# EAGLE design 4520_divider (EAGLE 7.5.0)
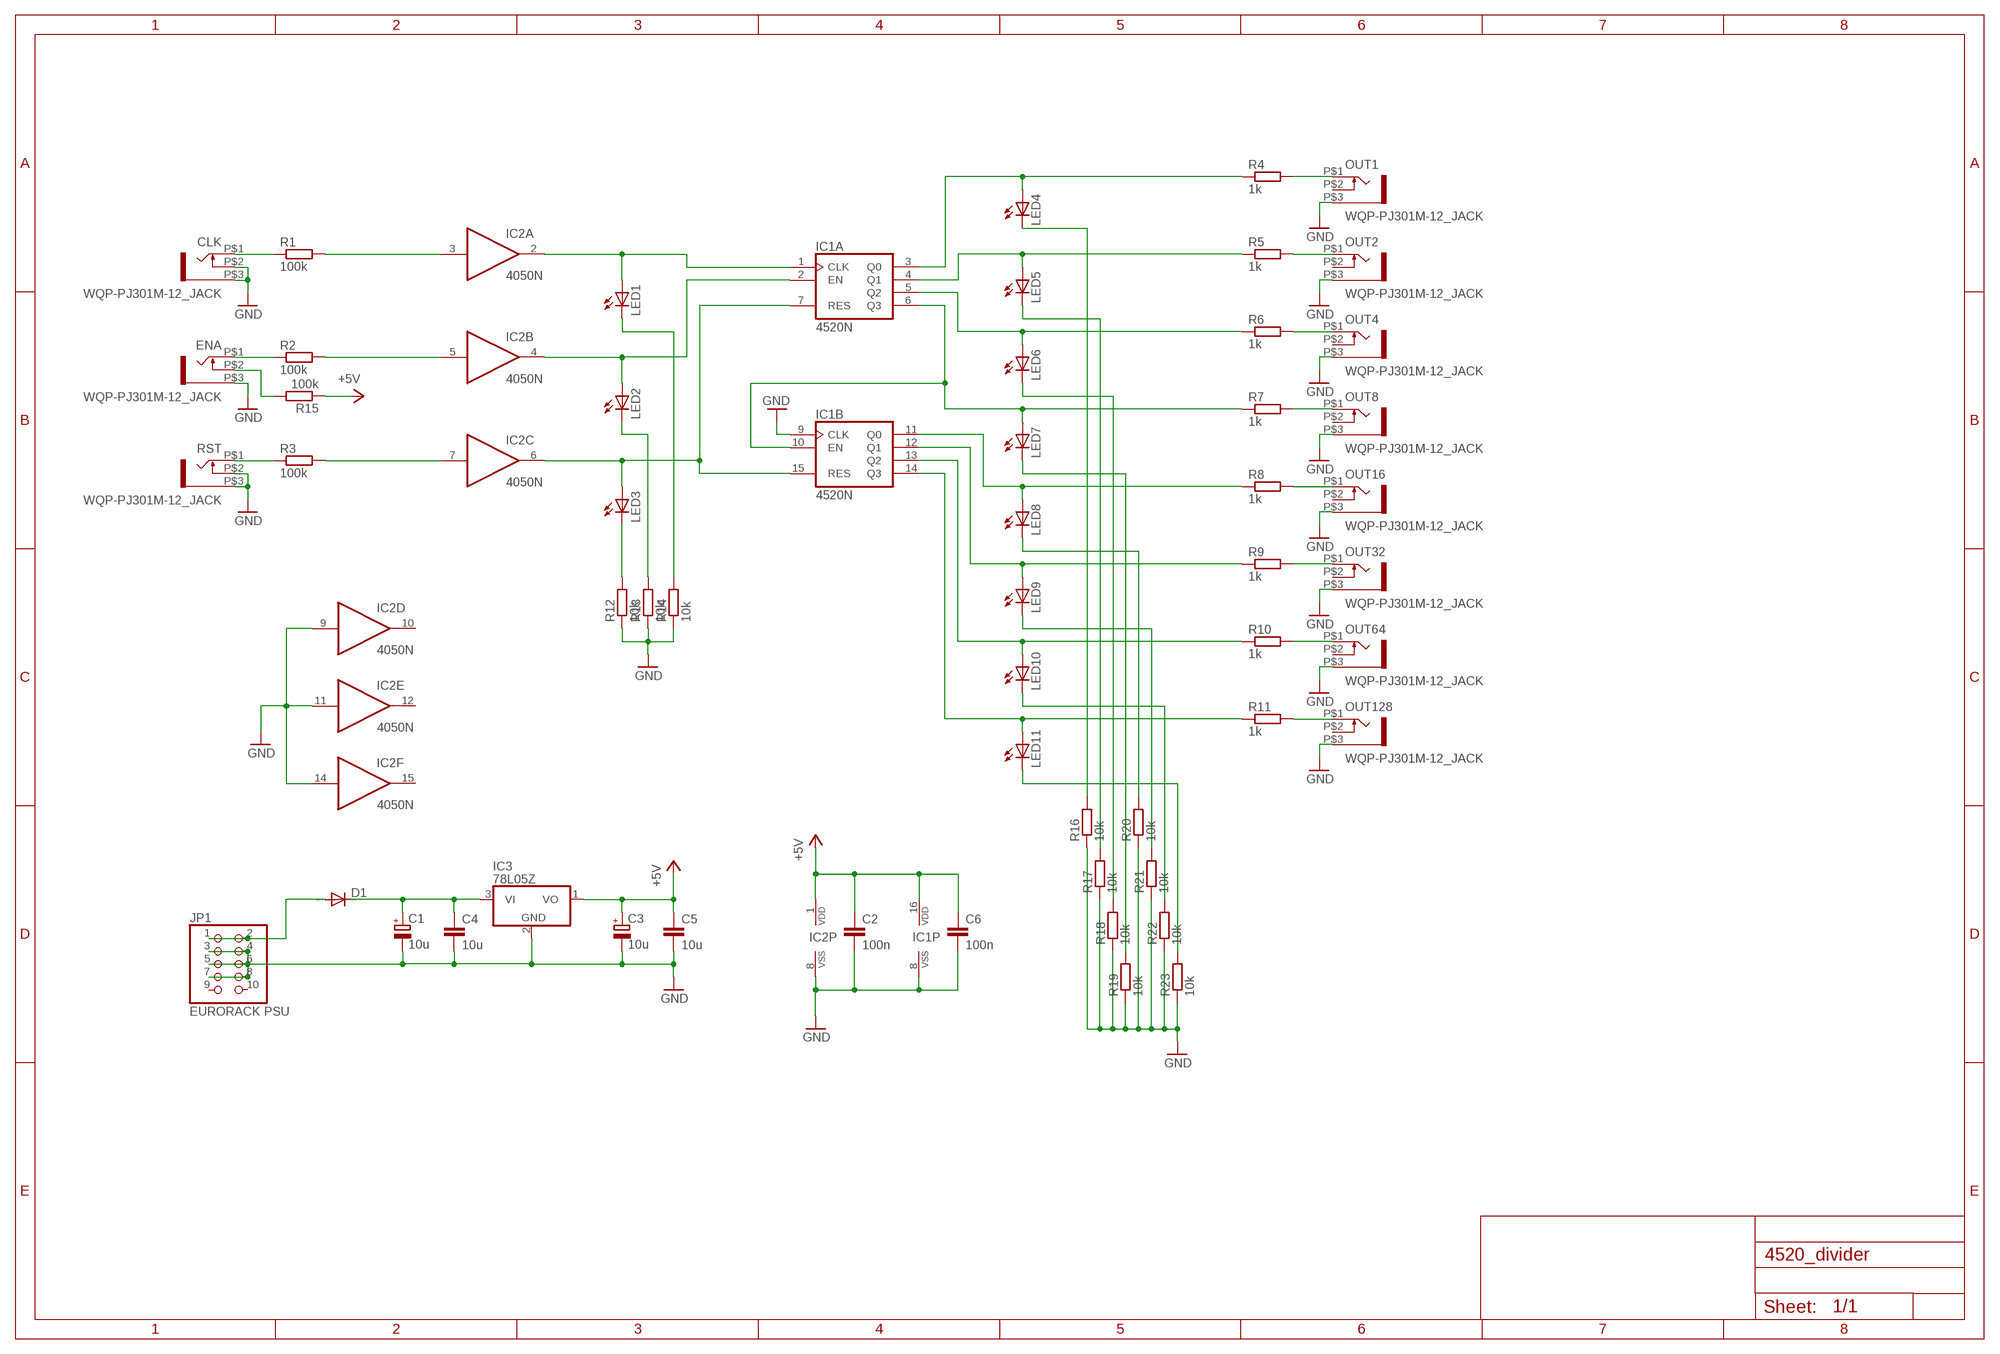
[diagram p0: schematic, sheet 1]

## Parts
C1  10u  CPOL-EUE2.5-5  [E2,5-5]
C2  100n  C-EU025-025X050  [C025-025X050]
C3  10u  CPOL-EUE2.5-5  [E2,5-5]
C4  10u  C-EUC1206K  [C1206K]
C5  10u  C-EUC1206K  [C1206K]
C6  100n  C-EU025-025X050  [C025-025X050]
CLK  WQP-PJ301M-12_JACK  [WQP-PJ301M-12_JACK]
D1  DIODE-D-2.5  [D-2.5]
ENA  WQP-PJ301M-12_JACK  [WQP-PJ301M-12_JACK]
IC1  4520N  [DIL16]
IC2  4050N  [DIL16]
IC3  78L05Z  [TO92]
JP1  EURORACK PSU  PINHD-2X5  [2X05]
LED1  LED3MM  [LED3MM]
LED2  LED3MM  [LED3MM]
LED3  LED3MM  [LED3MM]
LED4  LED3MM  [LED3MM]
LED5  LED3MM  [LED3MM]
LED6  LED3MM  [LED3MM]
LED7  LED3MM  [LED3MM]
LED8  LED3MM  [LED3MM]
LED9  LED3MM  [LED3MM]
LED10  LED3MM  [LED3MM]
LED11  LED3MM  [LED3MM]
OUT1  WQP-PJ301M-12_JACK  [WQP-PJ301M-12_JACK]
OUT2  WQP-PJ301M-12_JACK  [WQP-PJ301M-12_JACK]
OUT4  WQP-PJ301M-12_JACK  [WQP-PJ301M-12_JACK]
OUT8  WQP-PJ301M-12_JACK  [WQP-PJ301M-12_JACK]
OUT16  WQP-PJ301M-12_JACK  [WQP-PJ301M-12_JACK]
OUT32  WQP-PJ301M-12_JACK  [WQP-PJ301M-12_JACK]
OUT64  WQP-PJ301M-12_JACK  [WQP-PJ301M-12_JACK]
OUT128  WQP-PJ301M-12_JACK  [WQP-PJ301M-12_JACK]
R1  100k  R-EU_0204/2V  [0204V]
R2  100k  R-EU_0204/2V  [0204V]
R3  100k  R-EU_0204/2V  [0204V]
R4  1k  R-EU_R1206  [R1206]
R5  1k  R-EU_R1206  [R1206]
R6  1k  R-EU_R1206  [R1206]
R7  1k  R-EU_R1206  [R1206]
R8  1k  R-EU_R1206  [R1206]
R9  1k  R-EU_R1206  [R1206]
R10  1k  R-EU_R1206  [R1206]
R11  1k  R-EU_R1206  [R1206]
R12  10k  R-EU_R1206  [R1206]
R13  10k  R-EU_R1206  [R1206]
R14  10k  R-EU_R1206  [R1206]
R15  100k  R-EU_0204/2V  [0204V]
R16  10k  R-EU_R1206  [R1206]
R17  10k  R-EU_R1206  [R1206]
R18  10k  R-EU_R1206  [R1206]
R19  10k  R-EU_R1206  [R1206]
R20  10k  R-EU_R1206  [R1206]
R21  10k  R-EU_R1206  [R1206]
R22  10k  R-EU_R1206  [R1206]
R23  10k  R-EU_R1206  [R1206]
RST  WQP-PJ301M-12_JACK  [WQP-PJ301M-12_JACK]

## Nets
+5V: C2.1 C3.+ C5.1 C6.1 IC1.16(P:VDD) IC2.1(P:VDD) IC3.1(VO) R15.1
+12V_IN: D1.A JP1.1 JP1.2
GND: C1.- C2.2 C3.- C4.2 C5.2 C6.2 CLK.P$2 CLK.P$3 ENA.P$3 IC1.8(P:VSS) IC1.9(B:CLK) IC2.8(P:VSS) IC2.9(D:I) IC2.11(E:I) IC2.14(F:I) IC3.2(GND) JP1.3 JP1.4 JP1.5 JP1.6 JP1.7 JP1.8 OUT1.P$3 OUT2.P$3 OUT4.P$3 OUT8.P$3 OUT16.P$3 OUT32.P$3 OUT64.P$3 OUT128.P$3 R12.1 R13.1 R14.1 R16.1 R17.1 R18.1 R19.1 R20.1 R21.1 R22.1 R23.1 RST.P$2 RST.P$3
N$1: OUT1.P$1 R4.2
N$2: IC1.4(A:Q1) LED5.A R5.1
N$3: IC1.3(A:Q0) LED4.A R4.1
N$4: LED4.K(C) R16.2
N$5: OUT2.P$1 R5.2
N$6: OUT4.P$1 R6.2
N$7: C1.+ C4.1 D1.C IC3.3(VI)
N$8: IC1.5(A:Q2) LED6.A R6.1
N$9: LED5.K(C) R17.2
N$10: LED6.K(C) R18.2
N$11: LED7.K(C) R19.2
N$12: LED8.K(C) R20.2
N$13: LED9.K(C) R21.2
N$14: LED10.K(C) R22.2
N$15: LED11.K(C) R23.2
N$16: OUT8.P$1 R7.2
N$17: OUT16.P$1 R8.2
N$18: OUT32.P$1 R9.2
N$19: OUT64.P$1 R10.2
N$20: OUT128.P$1 R11.2
N$21: IC1.6(A:Q3) IC1.10(B:EN) LED7.A R7.1
N$22: IC1.11(B:Q0) LED8.A R8.1
N$23: IC1.12(B:Q1) LED9.A R9.1
N$24: IC1.13(B:Q2) LED10.A R10.1
N$25: IC1.14(B:Q3) LED11.A R11.1
N$26: IC2.3(A:I) R1.2
N$27: IC2.5(B:I) R2.2
N$28: IC1.1(A:CLK) IC2.2(A:O) LED1.A
N$29: IC1.2(A:EN) IC2.4(B:O) LED2.A
N$30: IC1.7(A:RES) IC1.15(B:RES) IC2.6(C:O) LED3.A
N$31: LED3.K(C) R12.2
N$32: LED2.K(C) R13.2
N$33: LED1.K(C) R14.2
N$34: IC2.7(C:I) R3.2
N$37: CLK.P$1 R1.1
N$38: ENA.P$1 R2.1
N$39: R3.1 RST.P$1
N$40: ENA.P$2 R15.2
Unconnected: IC2.10(D:O) IC2.12(E:O) IC2.15(F:O) JP1.9 JP1.10 OUT1.P$2 OUT2.P$2 OUT4.P$2 OUT8.P$2 OUT16.P$2 OUT32.P$2 OUT64.P$2 OUT128.P$2

## Library data of the parts
C1 C3 = rcl:CPOL-EU: POLARIZED CAPACITOR, European symbol
C2 C4-C6 = rcl:C-EU: CAPACITOR, European symbol
CLK ENA OUT1 OUT2 OUT4 OUT8 OUT16 OUT32 OUT64 OUT128 RST = thonkiconn:WQP-PJ301M-12_JACK
D1 = diode:DIODE-: DIODE
IC1 = 45xx:4520: Dual binary up COUNTER
IC2 = 40xx:4050: Hex non-inverting BUFFER
IC3 = linear:78*: Positive VOLTAGE REGULATOR Source: http://cache.national.com/ds/LM/LM78L05.pdf http://www.fairchildsemi.com/ds/LM/LM7805.pdf
JP1 = pinhead:PINHD-2X5: PIN HEADER
LED1-LED11 = led:LED: LED OSRAM: - CHIPLED LG R971, LG N971, LY N971, LG Q971, LY Q971, LO R971, LY R971 LH N974, LH R974 LS Q976, LO Q976, LY Q976 LO Q996 - Hyper CHIPLED LW Q18S LB Q993, LB Q99A, LB R99A - SideLED LS A670, LO A670, LY A670, LG A670, LP A670 LB A673, LV A673, LT A673, LW A673 LH A674 LY A675 LS A676, LA A676, LO A676, LY A676, LW A676 LS A679, LY A679, LG A679 - Hyper Micro SIDELED® LS Y876, LA Y876, LO Y876, LY Y876 LT Y87S - SmartLED LW L88C, LW L88S LB L89C, LB L89S, LG L890 LS L89K, LO L89K, LY L89K LS L896, LA L896, LO L896, LY L896 - TOPLED LS T670, LO T670, LY T670, LG T670, LP T670 LSG T670, LSP T670, LSY T670, LOP T670, LYG T670 LG T671, LOG T671, LSG T671 LB T673, LV T673, LT T673, LW T673 LH T674 LS T676, LA T676, LO T676, LY T676, LB T676, LH T676, LSB T676, LW T676 LB T67C, LV T67C, LT T67C, LS T67K, LO T67K, LY T67K, LW E67C LS E67B, LA E67B, LO E67B, LY E67B, LB E67C, LV E67C, LT E67C LW T67C LS T679, LY T679, LG T679 LS T770, LO T770, LY T770, LG T770, LP T770 LB T773, LV T773, LT T773, LW T773 LH T774 LS E675, LA E675, LY E675, LS T675 LS T776, LA T776, LO T776, LY T776, LB T776 LHGB T686 LT T68C, LB T68C - Hyper Mini TOPLED® LB M676 - Mini TOPLED Santana® LG M470 LS M47K, LO M47K, LY M47K Source: http://www.osram.convergy.de LUXEON: - LUMILED® LXK2-PW12-R00, LXK2-PW12-S00, LXK2-PW14-U00, LXK2-PW14-V00 LXK2-PM12-R00, LXK2-PM12-S00, LXK2-PM14-U00 LXK2-PE12-Q00, LXK2-PE12-R00, LXK2-PE12-S00, LXK2-PE14-T00, LXK2-PE14-U00 LXK2-PB12-K00, LXK2-PB12-L00, LXK2-PB12-M00, LXK2-PB14-N00, LXK2-PB14-P00, LXK2-PB14-Q00 LXK2-PR12-L00, LXK2-PR12-M00, LXK2-PR14-Q00, LXK2-PR14-R00 LXK2-PD12-Q00, LXK2-PD12-R00, LXK2-PD12-S00 LXK2-PH12-R00, LXK2-PH12-S00 LXK2-PL12-P00, LXK2-PL12-Q00, LXK2-PL12-R00 Source: www.luxeon.com KINGBRIGHT: KA-3528ASYC Source: www.kingbright.com
R1-R23 = rcl:R-EU_: RESISTOR, European symbol

## Board
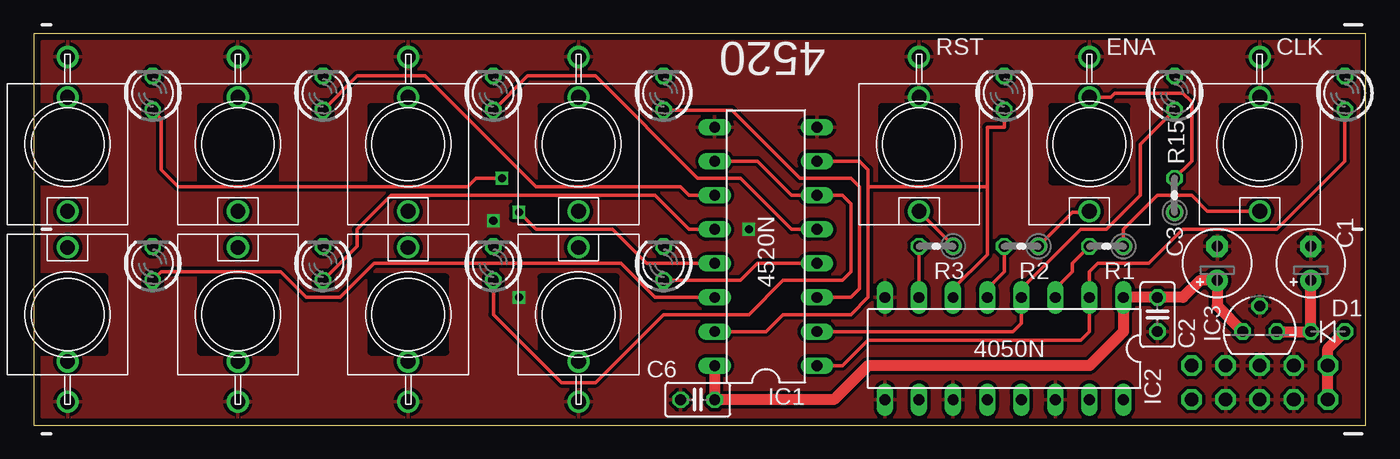
[diagram p1: board, top side]
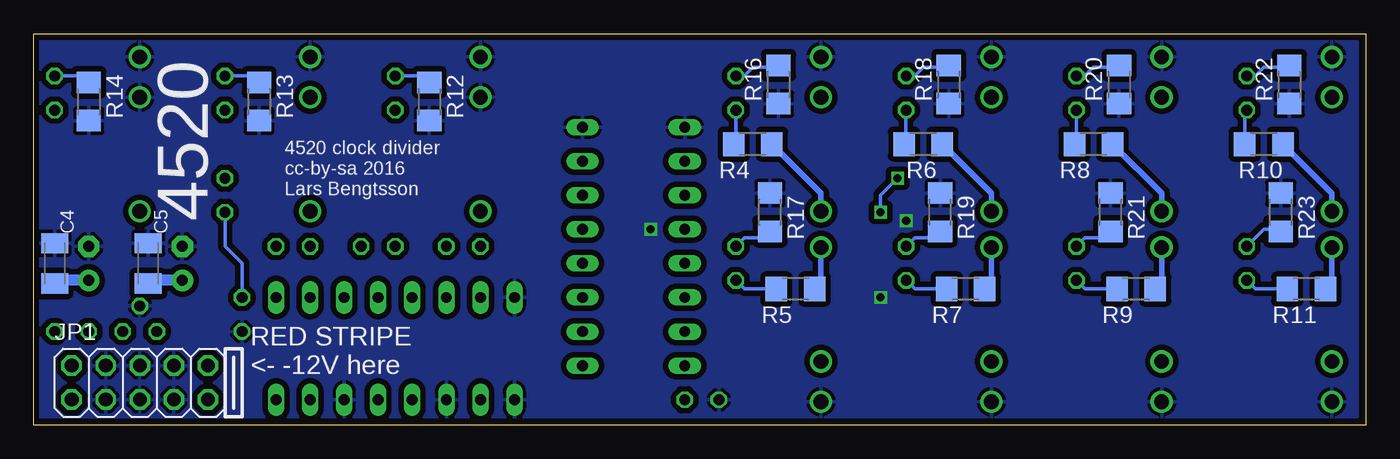
[diagram p2: board, bottom side, seen from below]

Size 99.36 x 29.2 mm. Coordinates in mm from the lower left corner, seen from the top.
Outline: 0,0 99.36,0 99.36,29.2 0,29.2 0,0
Copper layers (1*16): Top 0.0356mm / dielectric 1.5011mm / Bottom 0.0356mm
Design rules "LaenPCBOrder": minimum track width 6mil, minimum drill 13mil, track to track 6mil, track to pad 6mil, pad to pad 6mil, via to via 6mil, smd to smd 6mil, copper to edge 15mil, drill to drill 6mil, minimum pad ring 7mil, minimum via ring 7mil, stop-mask expansion 3mil, vias tented up to drill 0mil, thermal gap 10mil

### Footprints (pad centres in the part's own frame; a part is rotated, then mirrored left to right if it is on the bottom)
E2,5-5 = drill 0.813 pad 1.6: + -1.27,0 | drill 0.813 pad 1.6 octagon: - 1.27,0
C025-025X050 = drill 0.813 octagon: 1 -1.27,0; 2 1.27,0
C1206K = smd 1.5 x 2: 1 -1.5,0; 2 1.5,0
WQP-PJ301M-12_JACK = drill 1.1: P$1 0,5; P$2 0,-3.5; P$3 0,-6.5
D-2.5 = drill 0.813 octagon: A 1.27,0; C -1.27,0
DIL16 = drill 0.813 long: 1 -8.89,-3.81; 2 -6.35,-3.81; 3 -3.81,-3.81; 4 -1.27,-3.81; 5 1.27,-3.81; 6 3.81,-3.81; 7 6.35,-3.81; 8 8.89,-3.81; 9 8.89,3.81; 10 6.35,3.81; 11 3.81,3.81; 12 1.27,3.81; 13 -1.27,3.81; 14 -3.81,3.81; 15 -6.35,3.81; 16 -8.89,3.81
TO92 = drill 0.813 octagon: 1 -1.27,0; 2 0,1.905; 3 1.27,0
2X05 = drill 1.016 octagon: 1 -5.08,-1.27; 2 -5.08,1.27; 3 -2.54,-1.27; 4 -2.54,1.27; 5 0,-1.27; 6 0,1.27; 7 2.54,-1.27; 8 2.54,1.27; 9 5.08,-1.27; 10 5.08,1.27
LED3MM = drill 0.813 octagon: A -1.27,0; K 1.27,0
0204V = drill 0.813 octagon: 1 -1.27,0; 2 1.27,0
R1206 = smd 1.6 x 1.803: 1 -1.422,0; 2 1.422,0

### Placement (x,y rotation side)
C1  95.25,12.06 90 top
C2  83.82,8.26 270 top
C3  88.27,12.06 90 top
C4  97.79,12.06 90 bottom
C5  90.81,12.06 90 bottom
C6  49.53,1.91 180 top
CLK  91.44,20.95 180 top
D1  96.52,6.99 0 top
ENA  78.74,20.95 180 top
IC1  54.61,13.34 90 top
IC2  72.39,5.71 180 top
IC3  91.44,6.99 0 top
JP1  91.44,3.17 0 bottom
LED1  97.79,24.76 90 top
LED2  85.09,24.76 90 top
LED3  72.39,24.76 90 top
LED4  46.99,24.76 90 top
LED5  46.99,12.06 90 top
LED6  34.29,24.76 90 top
LED7  34.29,12.06 90 top
LED8  21.59,24.76 90 top
LED9  21.59,12.06 90 top
LED10  8.89,24.76 90 top
LED11  8.89,12.06 90 top
OUT1  40.64,20.95 180 top
OUT2  40.64,8.26 0 top
OUT4  27.94,20.95 180 top
OUT8  27.94,8.26 0 top
OUT16  15.24,20.95 180 top
OUT32  15.24,8.26 0 top
OUT64  2.54,20.95 180 top
OUT128  2.54,8.26 0 top
R1  80.01,13.34 180 top
R2  73.66,13.34 180 top
R3  67.31,13.34 180 top
R4  45.72,20.95 0 bottom
R5  42.55,10.16 0 bottom
R6  33.02,20.95 0 bottom
R7  29.84,10.16 0 bottom
R8  20.32,20.95 0 bottom
R9  17.14,10.16 0 bottom
R10  7.62,20.95 0 bottom
R11  4.45,10.16 0 bottom
R12  69.85,24.13 90 bottom
R13  82.55,24.13 90 bottom
R14  95.25,24.13 90 bottom
R15  85.09,17.14 90 top
R16  43.81,25.4 90 bottom
R17  44.45,15.88 270 bottom
R18  31.11,25.4 90 bottom
R19  31.75,15.88 270 bottom
R20  18.41,25.4 90 bottom
R21  19.05,15.88 270 bottom
R22  5.71,25.4 90 bottom
R23  6.35,15.88 270 bottom
RST  66.04,20.95 180 top

### Tracks (layer width: path | path; a pad name or v marks a point on that pad's centre or on a via)
+5V
  Top 0.813: IC1.16 C6.1 59.69,1.91 62.23,4.45 78.74,4.45 81.28,6.99 IC2.1 C2.1 85.72,9.53 87,10.79 C3.+ 88.27,8.89 IC3.1
  Bottom 0.254: R15.1 85.09,13.34 83.82,12.06 C2.1
  Bottom 0.813: C3.+ 90.81,10.79 C5.1
+12V_IN
  Top 0.813: JP1.1 JP1.2 96.52,5.71 D1.A
GND  (via drill 0.6)
  other vias: 34.29,15.24 36.2,9.53 53.34,14.61
  pour Bottom (isolate 0.406): 0.64,28.57 99.06,28.57 99.06,0.64 0.64,0.64
  pour Top (isolate 0.254): 0.64,28.57 99.06,28.57 99.06,0.64 0.64,0.64
N$1
  Bottom 0.406: OUT1.P$1 40.64,17.3 R4.2
N$2
  Top 0.254: IC1.4 53.98,12.06 52.7,10.79 LED5.A
  Bottom 0.254: LED5.A 46.35,10.16 R5.1
N$3
  Top 0.254: IC1.3 60.96,9.53 61.59,10.16 61.59,17.78 60.96,18.41 57.15,18.41 52.07,23.49 LED4.A
  Bottom 0.254: LED4.A 46.99,21.11 R4.1
N$4
  Bottom 0.254: LED4.K 46.35,26.04 45.72,26.67 43.97,26.67 R16.2
N$5
  Bottom 0.406: OUT2.P$1 40.64,10.64 R5.2
N$6
  Bottom 0.406: OUT4.P$1 27.94,17.3 R6.2
N$7
  Top 0.813: C1.+ D1.C IC3.3
  Bottom 0.813: C1.+ 97.79,10.79 C4.1
N$8
  Top 0.254: IC1.5 56.52,14.61 52.7,18.41 49.53,18.41 41.91,26.04 36.83,26.04 LED6.A
  Bottom 0.254: LED6.A 34.29,21.11 R6.1
N$9
  Bottom 0.254: LED5.K 46.35,13.97 44.93,13.97 R17.2
N$10
  Bottom 0.254: LED6.K 33.66,26.04 33.02,26.67 31.27,26.67 R18.2
N$11
  Bottom 0.254: LED7.K 33.66,13.97 32.23,13.97 R19.2
N$12
  Bottom 0.254: LED8.K 20.95,26.04 20.32,26.67 18.57,26.67 R20.2
N$13
  Bottom 0.254: LED9.K 20.95,13.97 19.53,13.97 R21.2
N$14
  Bottom 0.254: LED10.K 8.26,26.04 7.62,26.67 5.87,26.67 R22.2
N$15
  Bottom 0.254: LED11.K 7.62,14.61 6.5,14.61 R23.2
N$16
  Bottom 0.406: OUT8.P$1 27.94,10.64 R7.2
N$17
  Bottom 0.406: OUT16.P$1 15.24,17.3 R8.2
N$18
  Bottom 0.406: OUT32.P$1 15.24,10.64 R9.2
N$19
  Bottom 0.406: OUT64.P$1 2.54,17.3 R10.2
N$20
  Bottom 0.406: OUT128.P$1 2.54,10.64 R11.2
N$21
  Top 0.254: IC1.10 53.98,19.68 56.52,17.14 IC1.6 60.33,17.14 60.96,16.51 60.96,11.43 60.33,10.79 55.88,10.79 53.34,8.26 46.99,8.26 41.91,3.17 39.37,3.17 34.29,8.26 LED7.A
  Bottom 0.254: LED7.A 33.66,10.16 R7.1
N$22
  Top 0.254: IC1.11 48.9,17.14 48.26,17.78 37.47,17.78 29.21,26.04 24.13,26.04 LED8.A
  Bottom 0.254: LED8.A 21.59,21.11 R8.1
N$23
  Top 0.254: LED9.A 24.13,13.34 24.13,14.61 26.67,17.14 46.35,17.14 48.9,14.61 IC1.12
  Bottom 0.254: LED9.A 20.95,10.16 R9.1
N$24  (via drill 0.6)
  Top 0.254: v36.2,15.88 37.47,14.61 43.18,14.61 45.72,12.06 IC1.13 | v34.92,18.41 33.02,18.41 32.38,17.78 10.79,17.78 9.53,19.05 9.53,22.86 LED10.A
  Bottom 0.254: v36.2,15.88 36.2,17.14 v34.92,18.41 | R10.1 9.04,23.34 LED10.A
N$25
  Top 0.254: IC1.14 46.35,9.53 43.81,12.06 25.4,12.06 22.86,9.53 20.32,9.53 18.41,11.43 9.53,11.43 LED11.A
  Bottom 0.254: LED11.A 8.26,10.16 R11.1
N$26
  Top 0.254: R1.2 77.47,12.06 77.47,11.43 76.2,10.16 IC2.3
N$27
  Top 0.254: IC2.5 71.12,10.16 72.39,11.43 R2.2
N$28
  Top 0.254: IC1.1 60.33,4.45 62.23,6.35 78.11,6.35 78.74,6.99 IC2.2 78.74,11.43 79.38,12.06 83.19,12.06 85.72,14.61 92.71,14.61 97.79,19.68 LED1.A
N$29
  Top 0.254: LED2.A 82.55,20.95 82.55,17.14 80.01,14.61 78.11,14.61 73.66,10.16 IC2.4 73.66,7.62 73.03,6.99 IC1.2
N$30
  Top 0.254: LED3.A 72.39,22.22 71.12,22.22 71.12,17.78 | 71.12,17.78 71.12,12.7 68.58,10.16 IC2.6 | 62.23,17.78 71.12,17.78 | IC1.7 61.59,19.68 62.23,19.05 62.23,17.78 | 62.23,17.78 62.23,9.53 60.96,8.26 55.88,8.26 54.61,6.99 IC1.15
N$31
  Bottom 0.254: LED3.K 70,26.04 R12.2
N$32
  Bottom 0.254: LED2.K 82.7,26.04 R13.2
N$33
  Bottom 0.254: LED1.K 95.4,26.04 R14.2
N$34
  Top 0.254: R3.2 IC2.7
N$37
  Top 0.254: CLK.P$1 87.55,15.96 86.36,17.14 83.82,17.14 81.28,14.61 R1.1
N$38
  Top 0.254: R2.1 77.47,15.88 78.66,15.88 ENA.P$1
N$39
  Top 0.254: R3.1 68.58,13.42 RST.P$1
N$40
  Top 0.254: ENA.P$2 80.33,24.45 80.64,24.76 85.72,24.76 86.36,24.13 86.36,19.68 R15.2

### Text on the board
tPlace: 4520
bPlace: 4520 clock divider / cc-by-sa 2016 / Lars Bengtsson | 4520 | RED STRIPE / <- -12V here